# EAGLE design Moduł_Pomiarowy (EAGLE 9.6.2)
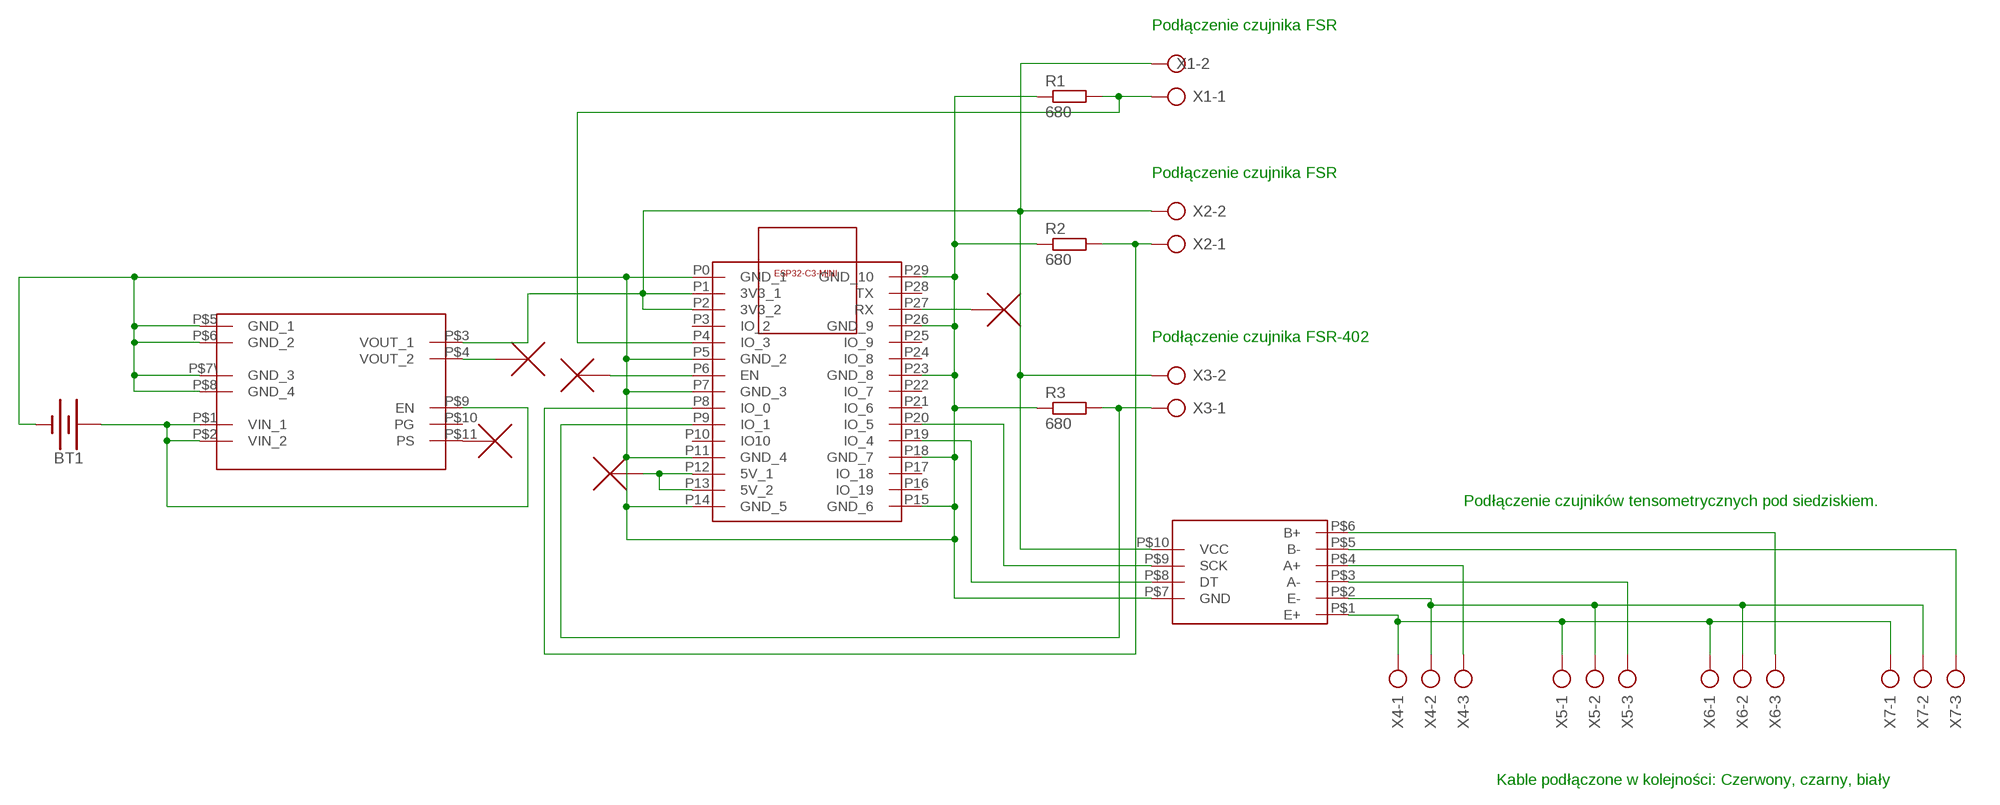
[diagram p0: schematic, sheet 1]

## Parts
BT1  SPARKFUN-BATTERIES_BATTERY-AA  [SPARKFUN-BATTERIES_BATTERY-AA]
R1  680  R-EU_0207/10  [0207/10]
R2  680  R-EU_0207/10  [0207/10]
R3  680  R-EU_0207/10  [0207/10]
U$1  PROJEKT_SE5_ESP32-C3-MINI-DEVKITESP32-C3-MINI  [PROJEKT_SE5_ESP32-C3-MINI]
U$2  PROJEKT_SE5_XFW-HX711  [PROJEKT_SE5_XFV-HX711]
U$3  PROJEKT_SE5_TPS63020-MODULE  [PROJEKT_SE5_TPS63020]
U$4  NC_MARKER_NC_MARKER  (no package)
U$5  NC_MARKER_NC_MARKER  (no package)
U$6  NC_MARKER_NC_MARKER  (no package)
U$7  NC_MARKER_NC_MARKER  (no package)
U$8  NC_MARKER_NC_MARKER  (no package)
X1  AK300/2  [AK300/2]
X2  AK300/2  [AK300/2]
X3  AK300/2  [AK300/2]
X4  AK300/3  [AK300/3]
X5  AK300/3  [AK300/3]
X6  AK300/3  [AK300/3]
X7  AK300/3  [AK300/3]

## Nets
GND: BT1.GND@1(-) R1.1 R2.1 R3.1 U$1.P0(GND_1) U$1.P5(GND_2) U$1.P7(GND_3) U$1.P11(GND_4) U$1.P14(GND_5) U$1.P15(GND_6) U$1.P18(GND_7) U$1.P23(GND_8) U$1.P26(GND_9) U$1.P29(GND_10) U$2.P$7(GND) U$3.P$5(GND_1) U$3.P$6(GND_2) U$3.P$7\(GND_3) U$3.P$8(GND_4)
N$1: BT1.PWR@1(+) U$3.P$1(VIN_1) U$3.P$2(VIN_2) U$3.P$9(EN)
N$2: U$2.P$1(E+) X4.1 X5.1 X6.1 X7.1
N$3: U$2.P$2(E-) X4.2 X5.2 X6.2 X7.2
N$4: U$1.P1(3V3_1) U$1.P2(3V3_2) U$2.P$10(VCC) U$3.P$3(VOUT_1) X1.2 X2.2 X3.2
N$5: U$2.P$4(A+) X4.3
N$6: U$2.P$3(A-) X5.3
N$7: U$2.P$6(B+) X6.3
N$8: R2.2 U$1.P8(IO_0) X2.1
N$9: R3.2 U$1.P9(IO_1) X3.1
N$10: R1.2 U$1.P4(IO_3) X1.1
N$11: U$2.P$5(B-) X7.3
N$13: U$1.P20(IO_5) U$2.P$9(SCK)
N$14: U$1.P19(IO_4) U$2.P$8(DT)
N$15: U$3.P$11(PS) U$8.P$1
N$17: U$3.P$4(VOUT_2) U$7.P$1
N$18: U$1.P12(5V_1) U$1.P13(5V_2) U$4.P$1
N$19: U$1.P6(EN) U$5.P$1
N$20: U$1.P27(RX) U$6.P$1
Unconnected: U$1.P3(IO_2) U$1.P10(IO10) U$1.P16(IO_19) U$1.P17(IO_18) U$1.P21(IO_6) U$1.P22(IO_7) U$1.P24(IO_8) U$1.P25(IO_9) U$1.P28(TX) U$3.P$10(PG)

## Notes on the sheet
- Podłączenie czujnika FSR
- Podłączenie czujnika FSR
- Podłączenie czujnika FSR-402
- Podłączenie czujników tensometrycznych pod siedziskiem.
- Kable podłączone w kolejności: Czerwony, czarny, biały

## Library data of the parts
BT1 = Library_Łukasz.Skowron:SPARKFUN-BATTERIES_BATTERY: Battery - Single Cell A variety of battery chemistries, sizes, and footprints. Device List: 20MM_PTH - Coin Cell Battery Holder - 20mm (PTH) <https://www.sparkfun.com/products/783> 20MM_PTH_KIT- Coin Cell battery Holder - 20 mm (PTH) <http://www.sparkfun.com/products/783>kit version with special mask 6.8MM_PTH - Coin Cell Battery Holder - 6.8MM(SMD) <https://www.digikey.com/product-detail/en/seiko-instruments/MS621FE-FL11E/728-1057-ND/1889208?WT.srch=1&gclid=CNOQ5a6LzdQCFZS2wAodXCkE0g> 12MM_SMD - Coin Cell Battery Holder - 12mm (SMD) <https://www.sparkfun.com/products/10592> 12MM_PTH - Coin Cell Battery Holder - 12mm (PTH) <https://www.sparkfun.com/products/7948> 20MM_SMD - 20mm Coin Cell Battery Holder (SMD) (2 legs) Used on the Big Time Watch Kit <https://www.sparkfun.com/products/11734> 20MM_SMD_4LEGS - Coin Cell Battery Holder - 20mm (SMD) <https://www.sparkfun.com/products/11892> 20MM_SMD_4LEGS_OVERPASTE - Coin Cell Battery Holder - 20mm (SMD) <https://www.sparkfun.com/products/11892> (Over-paste on the legs) 24.5MM_PTH - Coin Cell Battery Holder - 24.5mm (PTH) <https://www.sparkfun.com/products/8863> 9V - 9V Battery Holder - PC Mount Used on the SparkFun SparkPunk Sound Kit <https://www.sparkfun.com/products/11177> and SparkFun SparkPunk Sequencer Kit <https://www.sparkfun.com/products/12707> 18650 - Battery Holder - 18650 (PTH) <https://www.sparkfun.com/products/13113> AA - Battery Holder - 1xAA (PTH) <https://www.sparkfun.com/products/7949> AAA - Battery Holder - 1xAAA (PTH) <https://www.sparkfun.com/products/12718> AA_KIT - Battery Holder - 1xAA (PTH) <https://www.sparkfun.com/products/7949> Special kit package - pads only have exposed copper on one side of the board. AAA_KIT - Battery Holder - 1xAAA (PTH) <https://www.sparkfun.com/products/12718> Special kit package - pads only have exposed copper on one side of the board.; PROD_ID: BATT-08316; SF_SKU: PRT-07949
R1-R3 = rcl:R-EU_: RESISTOR, European symbol; SPICEPREFIX: R
U$1 = Library_Łukasz.Skowron:PROJEKT_SE5_ESP32-C3-MINI-DEVKIT: ESP32-C3-MINI-DEVKIT
U$2 = Library_Łukasz.Skowron:PROJEKT_SE5_XFW-HX711
U$3 = Library_Łukasz.Skowron:PROJEKT_SE5_TPS63020-MODULE
U$4-U$8 = Library_Łukasz.Skowron:NC_MARKER_NC_MARKER
X1-X3 = con-ptr500:AK300/2: CONNECTOR; OC_FARNELL: unknown; OC_NEWARK: unknown
X4-X7 = con-ptr500:AK300/3: CONNECTOR; OC_FARNELL: unknown; OC_NEWARK: unknown

## Board
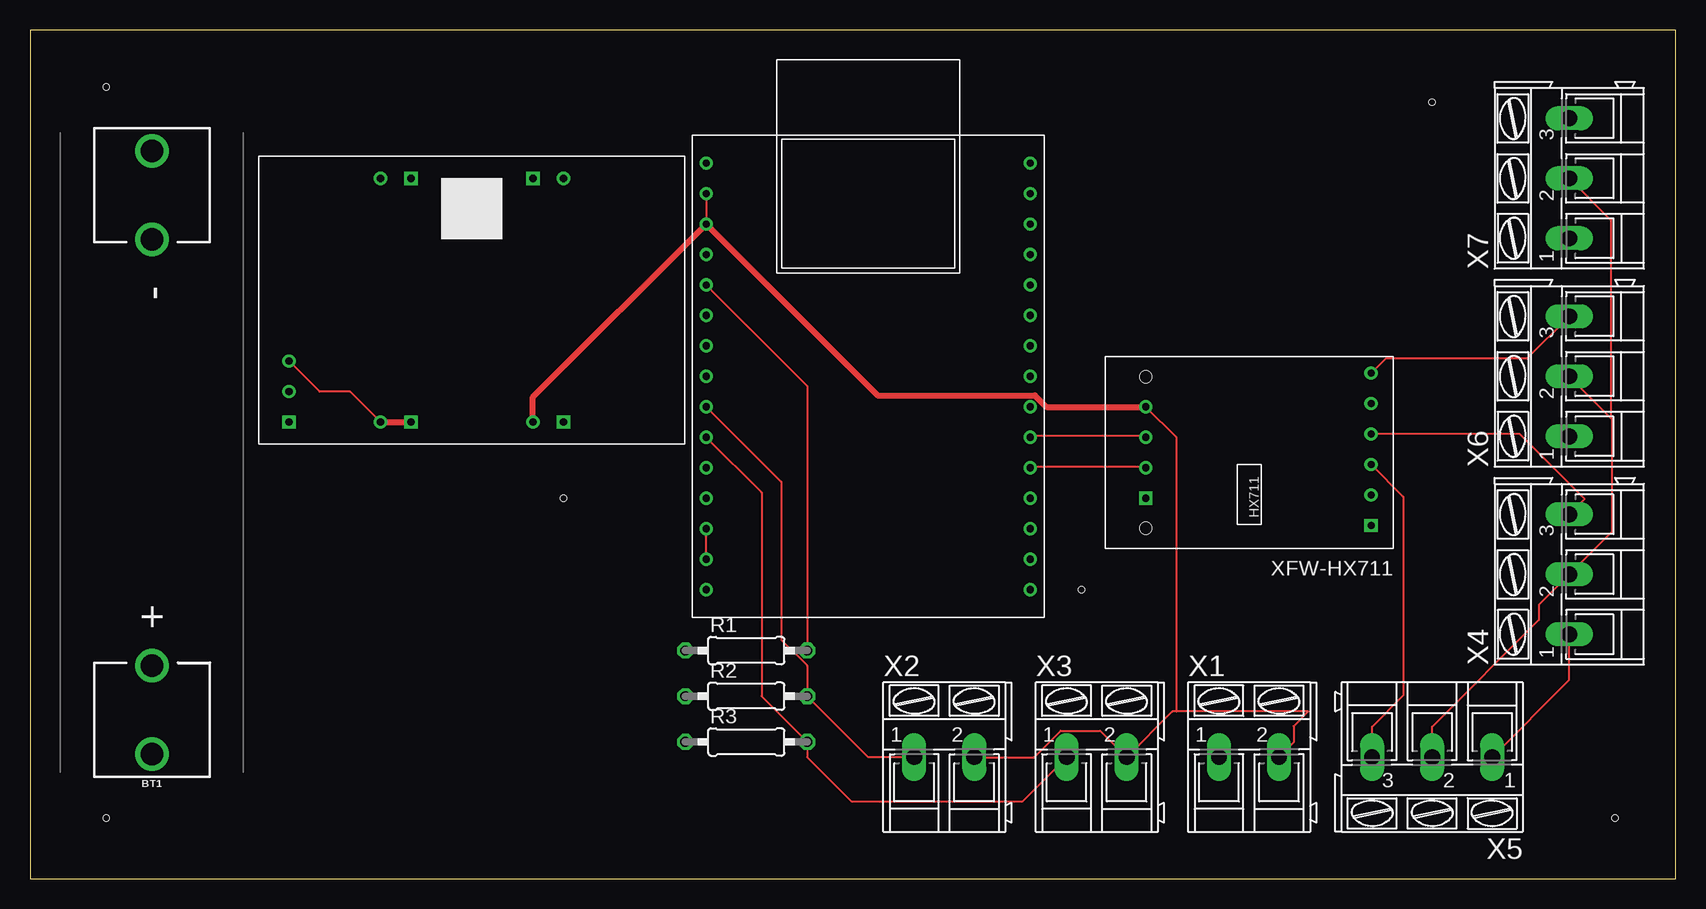
[diagram p1: board, top side]
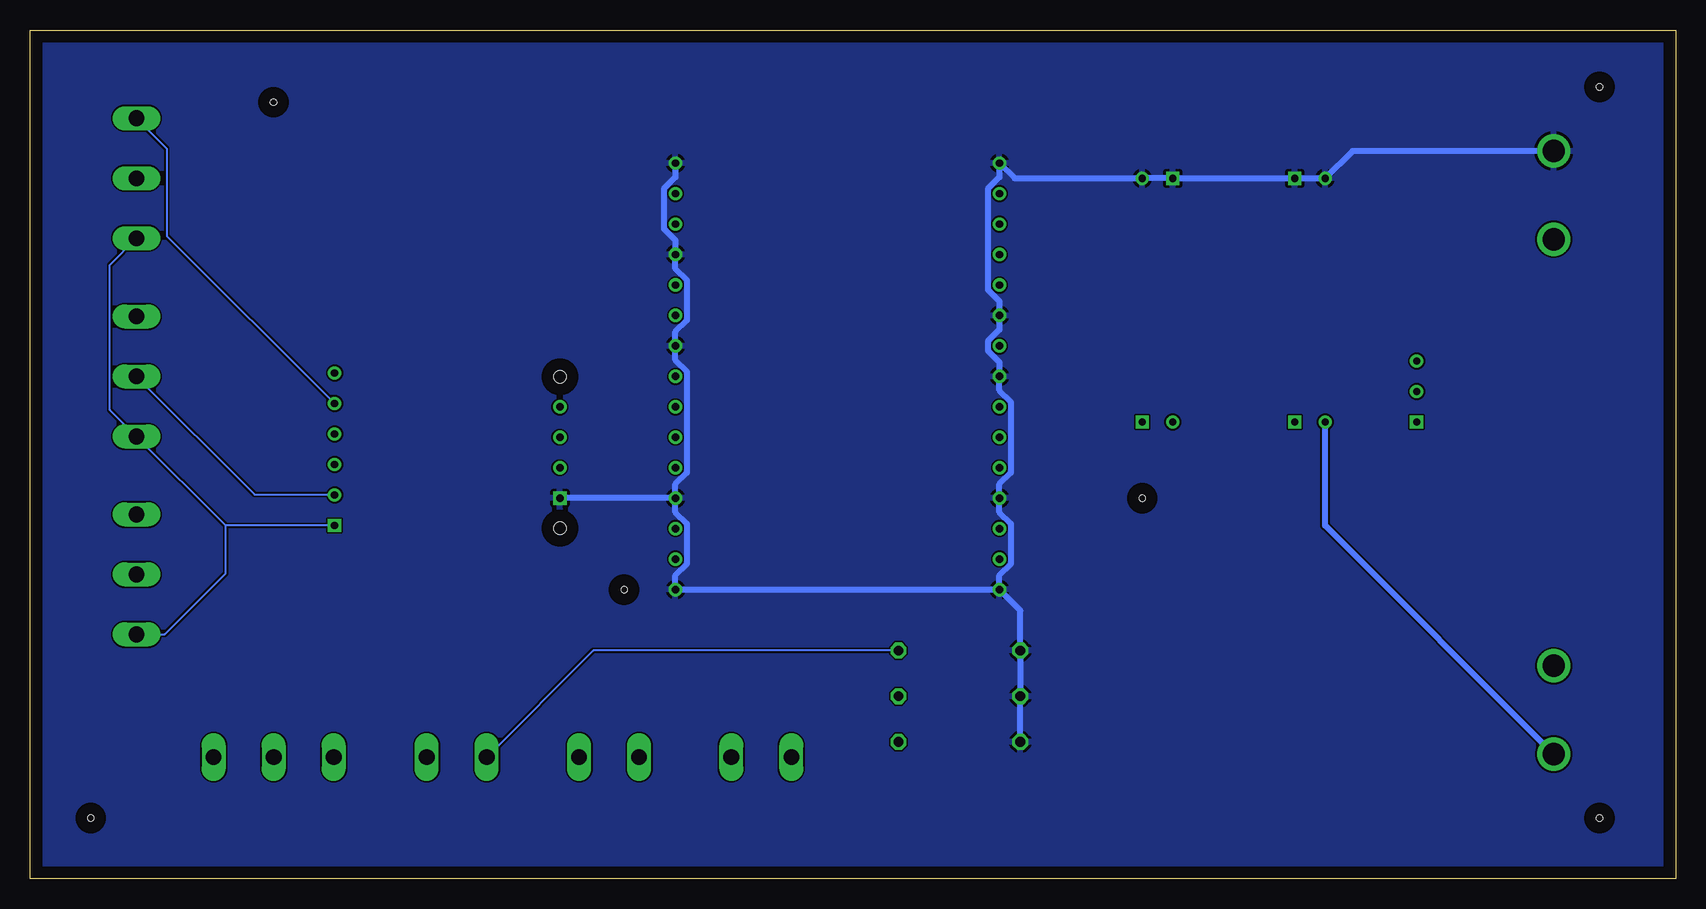
[diagram p2: board, bottom side, seen from below]

Size 137.14 x 70.79 mm. Coordinates in mm from the lower left corner, seen from the top.
Outline: 0,0 137.14,0 137.14,70.79 0,70.79 0,0
Copper layers (1*16): Top 0.035mm / dielectric 1.5mm / Bottom 0.035mm
Design rules "default": minimum track width 6mil, minimum drill 0.35mm, track to track 6mil, track to pad 6mil, pad to pad 6mil, via to via 6mil, smd to smd 6mil, copper to edge 40mil, drill to drill 6mil, minimum pad ring 10mil, minimum via ring 8mil, stop-mask expansion 4mil, vias tented up to drill 0mil, thermal gap 10mil
Holes 0.5 mm at 132.08,5.08 6.35,5.08 6.35,66.04 116.84,64.77 87.63,24.13 44.45,31.75

### Footprints (pad centres in the part's own frame; a part is rotated, then mirrored left to right if it is on the bottom)
SPARKFUN-BATTERIES_BATTERY-AA = drill 1.854: GND@1 25.146,0; GND@2 17.78,0; PWR@1 -25.146,0; PWR@2 -17.78,0
0207/10 = drill 0.813 octagon: 1 -5.08,0; 2 5.08,0
PROJEKT_SE5_ESP32-C3-MINI = drill 0.6: P0 -13.5,17.78; P1 -13.5,15.24; P2 -13.5,12.7; P3 -13.5,10.16; P4 -13.5,7.62; P5 -13.5,5.08; P6 -13.5,2.54; P7 -13.5,0; P8 -13.5,-2.54; P9 -13.5,-5.08; P10 -13.5,-7.62; P11 -13.5,-10.16; P12 -13.5,-12.7; P13 -13.5,-15.24; P14 -13.5,-17.78; P15 13.5,-17.78; P16 13.5,-15.24; P17 13.5,-12.7; P18 13.5,-10.16; P19 13.5,-7.62; P20 13.5,-5.08; P21 13.5,-2.54; P22 13.5,0; P23 13.5,2.54; P24 13.5,5.08; P25 13.5,7.62; P26 13.5,10.16; P27 13.5,12.7; P28 13.5,15.24; P29 13.5,17.78
PROJEKT_SE5_XFV-HX711 = drill 0.6 square: P$1 -10.16,6.08; P$7 8.62,3.81 | drill 0.6: P$2 -10.16,3.54; P$3 -10.16,1; P$4 -10.16,-1.54; P$5 -10.16,-4.08; P$6 -10.16,-6.62; P$8 8.62,1.27; P$9 8.62,-1.27; P$10 8.62,-3.81 | hole 1: 8.62,6.32; 8.62,-6.32
PROJEKT_SE5_TPS63020 = drill 0.6: P$1 -7.62,-10.16; P$3 5.08,-10.16; P$5 7.62,10.16; P$8 -7.62,10.16; P$9 -15.24,-5.08; P$10 -15.24,-7.62 | drill 0.6 square: P$2 -5.08,-10.16; P$4 7.62,-10.16; P$6 5.08,10.16; P$7\ -5.08,10.16; P$11 -15.24,-10.16
AK300/2 = drill 1.321 long: 1 -2.515,0; 2 2.489,0
AK300/3 = drill 1.321 long: 1 -5.004,0; 2 0,0; 3 5.004,0

### Placement (x,y rotation side)
BT1  10.16,35.56 90 top
R1  59.69,19.05 0 top
R2  59.69,15.24 0 top
R3  59.69,11.43 0 top
U$1  69.85,41.91 0 top
U$2  101.6,35.56 180 top
U$3  36.83,48.26 0 top
X1  101.6,10.16 0 top
X2  76.2,10.16 0 top
X3  88.9,10.16 0 top
X4  128.27,25.4 90 top
X5  116.84,10.16 180 top
X6  128.27,41.91 90 top
X7  128.27,58.42 90 top

### Tracks (layer width: path | path; a pad name or v marks a point on that pad's centre or on a via)
GND
  Bottom 0.508: R3.1 R2.1 R1.1 54.61,22.39 U$1.P14 | U$1.P14 56.35,25.31 55.39,26.27 55.39,29.61 56.35,30.57 U$1.P11 56.35,32.93 55.39,33.89 55.39,39.77 56.35,40.73 U$1.P7 56.35,43.09 57.31,44.05 57.31,44.85 56.35,45.81 U$1.P5 56.35,48.17 57.31,49.13 57.31,57.55 56.35,58.51 U$1.P0 55.08,58.42 U$3.P$5 U$3.P$6 U$3.P$7\ U$3.P$8 26.92,60.71 BT1.GND@1 | U$1.P14 U$1.P15 83.35,25.31 82.39,26.27 82.39,29.61 83.35,30.57 U$1.P18 | U$1.P18 U$2.P$7 | U$1.P18 83.35,32.93 82.39,33.89 82.39,42.31 83.35,43.27 U$1.P23 83.35,45.63 82.39,46.59 82.39,49.93 83.35,50.89 U$1.P26 83.35,53.25 84.31,54.21 84.31,57.55 83.35,58.51 U$1.P29
  pour Bottom: 0,69.85 137.16,69.85 137.16,0 0,0
N$1
  Top 0.152: U$3.P$9 24.13,40.64 26.67,40.64 U$3.P$1
  Top 0.508: U$3.P$1 U$3.P$2
  Bottom 0.508: BT1.PWR@1 29.21,29.46 U$3.P$1
N$2
  Top 0.152: X5.1 128.27,16.59 X4.1
  Bottom 0.152: X7.1 130.48,51.21 130.48,39.12 X6.1 120.84,29.48 | X4.1 125.92,20.4 120.84,25.48 120.84,29.48 | U$2.P$1 120.84,29.48
N$3
  Top 0.152: X5.2 116.84,12.7 125.73,21.59 125.73,22.86 X4.2 131.83,28.96 131.83,38.35 X6.2 131.75,38.43 131.75,54.94 X7.2
  Bottom 0.152: X6.2 118.42,32.05 111.76,32.05 U$2.P$2
N$4
  Top 0.152: U$1.P1 56.34,57.05 56.34,54.61 U$1.P2 | X1.2 105.31,11.38 105.31,12.75 106.53,13.97 95.55,13.97 | 95.55,13.97 95.2,13.97 X3.2 89.18,12.37 85.88,12.37 83.67,10.16 X2.2 | 95.55,13.97 95.55,36.8 U$2.P$10
  Top 0.508: U$3.P$3 41.91,40.18 56.34,54.61 | U$2.P$10 84.71,39.37 83.75,40.33 70.63,40.33 U$1.P2
N$5
  Top 0.152: U$2.P$4 111.76,37.08 124.15,37.08 129.55,31.69 X4.3
N$6
  Top 0.152: U$2.P$3 114.45,31.87 114.45,15.32 111.84,12.7 X5.3
N$7
  Top 0.152: U$2.P$6 112.96,43.38 124.74,43.38 X6.3
N$8
  Top 0.152: X2.1 69.85,10.16 R2.2 64.77,17.79 62.61,19.95 62.61,33.11 U$1.P8
N$9
  Top 0.152: X3.1 82.68,6.45 68.48,6.45 64.77,10.16 R3.2 60.96,15.24 60.96,32.22 U$1.P9
N$10
  Top 0.152: U$1.P4 64.77,41.11 R1.2
  Bottom 0.152: R1.2 90.19,19.05 X1.1
N$11
  Bottom 0.152: U$2.P$5 125.73,53.61 125.73,60.88 X7.3
N$13
  Top 0.152: U$1.P20 83.46,36.93 93.08,36.93 U$2.P$9
N$14
  Top 0.152: U$1.P19 83.46,34.34 92.86,34.34 U$2.P$8
N$18
  Top 0.152: U$1.P13 U$1.P12